# Altium schematic sheet CompSchm.SchDoc
size A; SheetNumber: 1; SheetTotal: 1
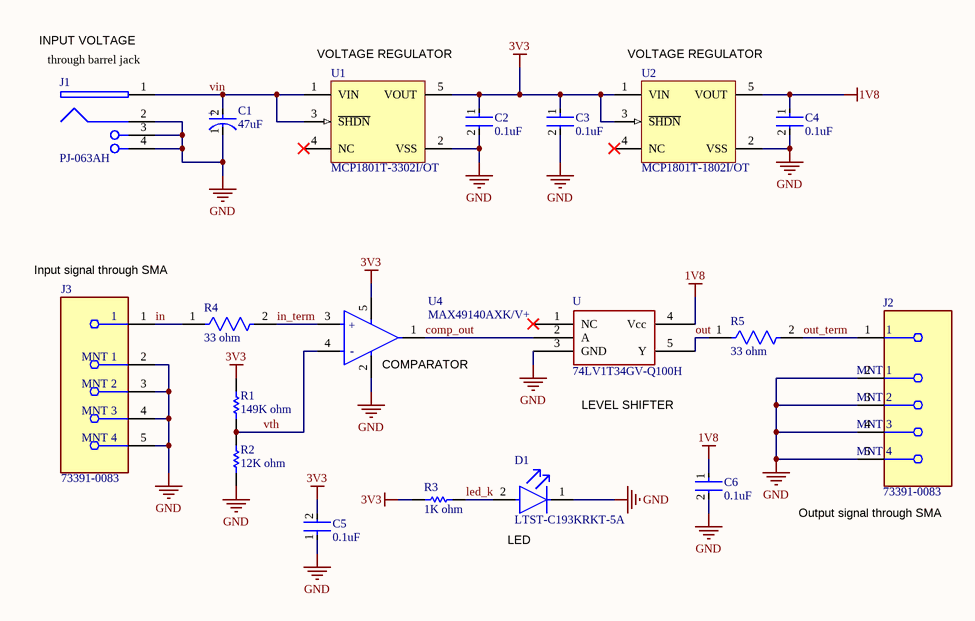
[diagram p0: CompSchm.SchDoc]

## Parts
C1  47uF  [FP-T491X476K035AT-MFG]
C2  0.1uF  [FP-CL21-IPC_C]
C3  0.1uF  [FP-CL21-IPC_C]
C4  0.1uF  [FP-CL21-IPC_C]
C5  0.1uF  [FP-CL21-IPC_C]
C6  0.1uF  [FP-CL21-IPC_C]
D1  LTST-C193KRKT-5A  [FP-LTST-C193KRKT-5A-MFG]
J1  PJ-063AH  [CUI-PJ-063AH_V]
J2  73391-0083  [FP-73391-0083-MFG]
J3  73391-0083  [FP-73391-0083-MFG]
R1  149K ohm  [RESC2013X50X40NL20T20]
R2  12K ohm  [RESC2013X50X40NL20T20]
R3  1K ohm  [RESC2013X50X40NL20T20]
R4  33 ohm  [FP-CRGCQ0805-IPC_C]
R5  33 ohm  [FP-CRGCQ0805-IPC_C]
U  74LV1T34GV-Q100H  [SOT95P275X110-5N]
U1  MCP1801T-3302I/OT  [SOT-23-OT5_M]
U2  MCP1801T-1802I/OT  [SOT-23-OT5_M]
U4  MAX49140AXK/V+  [FP-X5-1C-MFG]

## Nets
1V8: C4.1 C6.1 U.4(Vcc) U2.5(VOUT)
3V3: C2.1 C3.1 C5.2 R1.2 R3.2 U1.5(VOUT) U2.1(VIN) U2.3(~{SHDN}) U4.5(VDD)
GND: C1.1(C) C2.2 C3.2 C4.2 C5.1 C6.2 D1.1(C) J1.2 J1.3(SHLD) J1.4(SHLD) J2.2(MNT_1) J2.3(MNT_2) J2.4(MNT_3) J2.5(MNT_4) J3.2(MNT_1) J3.3(MNT_2) J3.4(MNT_3) J3.5(MNT_4) R2.1 U.3(GND) U1.2(VSS) U2.2(VSS) U4.2(GND)
comp_out: U.2(A) U4.1(OUT)
in: J3.1 R4.1
in_term: R4.2 U4.3(IN+)
led_k: D1.2(A) R3.1
out: R5.1 U.5(Y)
out_term: J2.1 R5.2
vin: C1.2(A) J1.1 U1.1(VIN) U1.3(~{SHDN})
vth: R1.1 R2.2 U4.4(IN-)

Not connected (* = marked no-connect by the designer): U 1(NC)*; U1 4(NC)*; U2 4(NC)*

## Notes on the sheet
- (near J1) INPUT VOLTAGE
- (near J1) through barrel jack
- (near U1) VOLTAGE REGULATOR
- (near U2) VOLTAGE REGULATOR
- Input signal through SMA
- (near U4) COMPARATOR
- (near U) LEVEL SHIFTER
- (near J2) Output signal through SMA
- (near D1) LED
- (in symbol CMP-03017-000044-1) +
- (in symbol CMP-05700-000010-1) +; -

## Library data of the parts
C1 = CMP-03017-000044-1: CAP TANT 47UF 10% 35V 2917 Part: T491X476K035AT; Ripple Current: 524mA; Polarity: Polar; Life (Hours): 2000Hour; Dissipation Factor: 8%; Leakage Current: 16.5uA; ESR (Equivalent Series Resistance): 600mR; Dielectric Material: Tantalum; Termination: SMD/SMT; Tolerance: 10%; Case Code (Metric): 7343; Radiation Hardening: No; Height: 4mm; Width: 4.3mm; Lead Free: Lead Free; Package Quantity: 1; Case Code (Imperial): 2917; Voltage Rating: 35V; Number of Pins: 2; Max Operating Temperature: 125°C; RoHS Compliant: Yes; Length: 7.3mm; Construction: Flat; Voltage Rating (DC): 35V; Capacitance: 47uF; Features: General Purpose; Voltage: 35V; REACH SVHC: No SVHC; Mount: Surface Mount; Series: T491; Case/Package: 2917; Height - Seated (Max): 0.169inch; Depth: 4.3mm; Packaging: Tape and Reel; Min Operating Temperature: -55°C
C2-C6 = CMP-13271-002854-1: CL21 Series 0805 100nF 25V ±10% Tolerance X7R Multilayer Ceramic Chip Capacitor; Thickness: 0.037inch; Dielectric: X7R; Packaging: Tape and Reel; Height: 0.85mm; Case/Package: 0805; Mount: Surface Mount; Case Code (Imperial): 0805; Capacitance: 100nF; Case Code (Metric): 2012; Length: 2mm; Voltage Rating: 25V; Voltage: 25V; Contact Plating: Tin; Tolerance: 10%; Max Operating Temperature: 125°C; Width: 0.049inch; Min Operating Temperature: -55°C; Radiation Hardening: No; Package Quantity: 1; Depth: 1.25mm
D1 = CMP-2000-06623-2: LED RED CLEAR CHIP SMD; Power Dissipation: 50mW; Lens Style: Diffused; Test Current: 5mA; Dominant Wavelength: 631nm; Reverse Voltage: 5V; Number of Elements: 1; Viewing Angle: 130°; Luminous Intensity: 45mcd; Lens Color: Colorless; Forward Voltage: 2.3V; Case Code (Imperial): 0603; Illumination Color: Red; Lead Free: Lead Free; Radiation Hardening: No; Width: 0.8mm; Number of Pins: 2; Packaging: Tape and Reel; Depth: 0.8mm; Height: 0.35mm; Mount: Surface Mount; Case Code (Metric): 1608; Forward Current: 5mA; Lens Transparency: Clear; Case/Package: 0603; Length: 1.6mm; Color: Red; Max Operating Temperature: 85°C; Number of LEDs: 1; Min Operating Temperature: -55°C; Package Quantity: 3000
J1 = CMP-2000-06898-1: Through Hole Right Angle DC Power Jack, 8 A, 2 mm Center Pin, 2 Position, -25 to 85 degC, RoHS, Bulk; Manufacturer: CUIInc.; Voltage Rating: 24V; Current Rating: 8A; Inside Contact Diameter: 2mm; Insulation Resistance: 100MOhms; Outside Contact Diameter: 6.5mm; Brand: CUI; Termination Style: ThroughHole; Flammability Rating: UL94V-0; Datasheet Version: Rev. 1.02, 03/2016; Manufacturer URL: http://www.cui.com/; Product Category: DCPowerConnectors; Package Description: 2-Pin Through Hole Device, Body 13 x 10 mm, Height 9 mm; Connector Type: DCPowerJack; Factory Pack Quantity: 500; Contact Plating: Nickel; Mounting Style: KinkedPin; Contact Material: Copper; RoHS: True; Mounting Angle: Right; Package Reference: PJ-063AH; Product: Jacks; Contact Gender: Male; Datasheet URL: http://www.cui.com/product/resource/pj-063ah.pdf; Housing Material: PolybutyleneTerephthalate(PBT); Mounting Technology: ThroughHole; Operating Temperature Range: -25Cto+85C
J2 J3 = CMP-04764-000017-1: SMA RA JACK, PCB; Impedance: 50R; Body Plating: Gold; Gender: Female; REACH SVHC: No SVHC; Mount: PCB; Contact Plating: Gold; Contact Material: Copper; Case/Package: SMA; Connector Type: SMA; Orientation: Right Angle; Termination: Solder; RoHS Compliant: Yes
R1-R3 = CMP-2001-04812-1: Part Number: RG2012N-123-W-T1; Manufacturer: Susumu
R4 R5 = CMP-03211-008574-1: CRGCQ0805 33Ω 0.125W ±200ppm/°C 1% 150V; Manufacturer Part Number: CRGCQ0805F33R; Manufacturer: TE Connectivity; Tolerance: 0.01; Automotive Grade: Grade 343; Category: Res; Temperature Range High: +155°C; RoHS: TRUE; Automotive: Yes; Voltage Rating: 150V; ComponentLink2Description: Datasheet; Temperature Coefficient: ±200ppm/°C; Resistance: 33Ω; Power Rating: 0.125W; Device Class L2: Resistors; Ambient Temperature Range High: +70°C; Device Class L3: Chip SMD Resistors; ComponentLink2URL: https://www.te.com/commerce/DocumentDelivery/DDEController?Action=showdoc&DocId=Data+Sheet%7F1773204-3%7F1%7Fpdf%7FEnglish%7FENG_DS_1773204-3_1.pdf%7F4-2176341-352; Device Class L1: Passive Components; Octopart: https://octopart.com/crgcq0805f33r-te+connectivity-91018172; Temperature Range Low: -55°C; Series: CRGCQ; Value: 33Ω; Composition: Thick Film; Height: 0.65mm; Package: CRGCQ0805; Temperature: -55°C to +155°C; Ipc Land Pattern Name: RESC200125X55; Lead Free: Yes
U = 74LV1T34GV-Q100H: Level Shifter
U1 = CMP-0136-00719-1: 150 mA, High PSRR, Low Quiescent Current LDO, 5-Pin SOT-23, Industrial Temperature, Tape and Reel; Code_IPC: SOT23-5; PackageVersion: revBB, Aug-2009; PackageReference: SOT-23-OT5; DatasheetVersion: revC, Jan-2009; PackageDescription: 5-Lead Plastic Small Outline Transistor (OT) [SOT-23]
U2 = CMP-0136-00723-1: 150 mA, High PSRR, Low Quiescent Current LDO, 5-Pin SOT-23, Industrial Temperature, Tape and Reel; PackageDescription: 5-Lead Plastic Small Outline Transistor (OT) [SOT-23]; DatasheetVersion: revC, Jan-2009; PackageVersion: revBB, Aug-2009; Code_IPC: SOT23-5; PackageReference: SOT-23-OT5
U4 = CMP-05700-000010-1: 30NS, LOW-POWER, 3V/5V, RAIL-TO-